# Altium schematic sheet E17-12-VCU-CONN.SchDoc
size A4
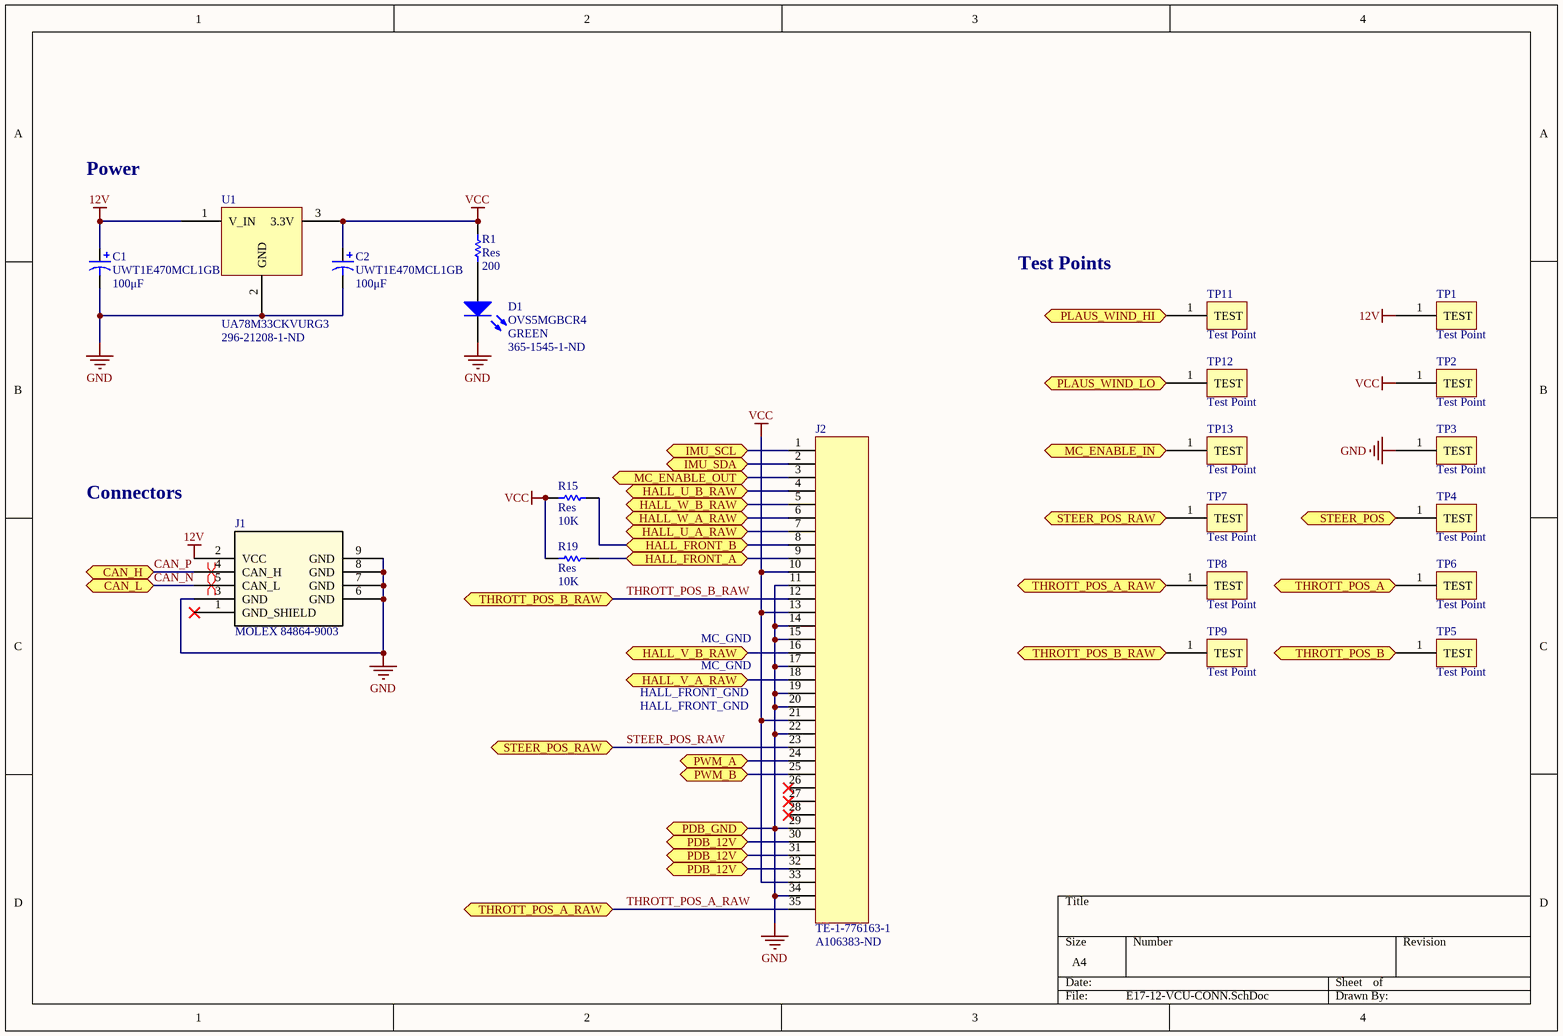
[diagram p0: E17-12-VCU-CONN.SchDoc]

## Parts
C1  UWT1E470MCL1GB  value 100μF  [UWT1E470MCL1GB]
C2  UWT1E470MCL1GB  value 100μF  [UWT1E470MCL1GB]
D1  OVS5MGBCR4  Colour: GREEN  Supplier Part Number 1: 365-1545-1-ND  [OVS5MGBCR4]
J1  MOLEX 84864-9003  [MOLEX 84864-9003]
J2  TE-1-776163-1  Supplier Part Number 1: A106383-ND  [TE-1-776163-1]
R1  Res  value 200  [2012[0805]]
R15  Res  value 10K  [2012[0805]]
R19  Res  value 10K  [2012[0805]]
TP1  Test Point  [TEST POINT 5000K]
TP2  Test Point  [TEST POINT 5000K]
TP3  Test Point  [TEST POINT 5000K]
TP4  Test Point  [TEST POINT 5000K]
TP5  Test Point  [TEST POINT 5000K]
TP6  Test Point  [TEST POINT 5000K]
TP7  Test Point  [TEST POINT 5000K]
TP8  Test Point  [TEST POINT 5000K]
TP9  Test Point  [TEST POINT 5000K]
TP11  Test Point  [TEST POINT 5000K]
TP12  Test Point  [TEST POINT 5000K]
TP13  Test Point  [TEST POINT 5000K]
U1  UA78M33CKVURG3  Supplier Part Number 1: 296-21208-1-ND  [TO-252-3]

## Ports
CAN_H, CAN_L, HALL_FRONT_A, HALL_FRONT_B, HALL_U_A_RAW, HALL_U_B_RAW, HALL_V_A_RAW, HALL_V_B_RAW, HALL_W_A_RAW, HALL_W_B_RAW, IMU_SCL, IMU_SDA, MC_ENABLE_IN, MC_ENABLE_OUT, PDB_12V, PDB_GND, PLAUS_WIND_HI, PLAUS_WIND_LO, PWM_A, PWM_B, STEER_POS, STEER_POS_RAW, THROTT_POS_A, THROTT_POS_A_RAW, THROTT_POS_B, THROTT_POS_B_RAW

## Nets
12V: C1.1 J1.2(VCC) TP1.1(TEST) U1.1(V_IN)
GND: C1.2 C2.2 D1.2(K) J1.3(GND) J1.6(GND) J1.7(GND) J1.8(GND) J1.9(GND) J2.11 J2.14 J2.15 J2.17 J2.19 J2.20 J2.22 J2.29 J2.34 TP3.1(TEST) U1.2(GND) ; port PDB_GND
VCC: C2.1 J2.10 J2.13 J2.21 J2.33 R1.2 R15.1 R19.2 TP2.1(TEST) U1.3(3.3V)
CAN_N: J1.5(CAN_L) ; port CAN_L
CAN_P: J1.4(CAN_H) ; port CAN_H
HALL_FRONT_A: J2.9 R19.1 ; port HALL_FRONT_A
HALL_FRONT_B: J2.8 R15.2 ; port HALL_FRONT_B
HALL_U_A_RAW: J2.7 ; port HALL_U_A_RAW
HALL_U_B_RAW: J2.4 ; port HALL_U_B_RAW
HALL_V_A_RAW: J2.18 ; port HALL_V_A_RAW
HALL_V_B_RAW: J2.16 ; port HALL_V_B_RAW
HALL_W_A_RAW: J2.6 ; port HALL_W_A_RAW
HALL_W_B_RAW: J2.5 ; port HALL_W_B_RAW
IMU_SCL: J2.1 ; port IMU_SCL
IMU_SDA: J2.2 ; port IMU_SDA
MC_ENABLE_IN: TP13.1(TEST) ; port MC_ENABLE_IN
MC_ENABLE_OUT: J2.3 ; port MC_ENABLE_OUT
PDB_12V: J2.30 J2.31 J2.32 ; port PDB_12V
PLAUS_WIND_HI: TP11.1(TEST) ; port PLAUS_WIND_HI
PLAUS_WIND_LO: TP12.1(TEST) ; port PLAUS_WIND_LO
PWM_A: J2.24 ; port PWM_A
PWM_B: J2.25 ; port PWM_B
STEER_POS: TP4.1(TEST) ; port STEER_POS
STEER_POS_RAW: J2.23 TP7.1(TEST) ; port STEER_POS_RAW
THROTT_POS_A: TP6.1(TEST) ; port THROTT_POS_A
THROTT_POS_A_RAW: J2.35 TP8.1(TEST) ; port THROTT_POS_A_RAW
THROTT_POS_B: TP5.1(TEST) ; port THROTT_POS_B
THROTT_POS_B_RAW: J2.12 TP9.1(TEST) ; port THROTT_POS_B_RAW
NetD1_1: D1.1(A) R1.1

Not connected (* = marked no-connect by the designer): J1 1(GND_SHIELD)*; J2 26* 27* 28*

## Layout directives
differential pair: CAN_N, CAN_P

## Notes on the sheet
- Power
- Test Points
- Connectors
- MC_GND
- HALL_FRONT_GND

## Library data of the parts
C1 C2 = UWT1E470MCL1GB: CAP ALUM 47UF 25V 20% SMD; Published: 8-Jun-2000; LatestRevisionDate: 17-Jul-2002; LatestRevisionNote: Re-released for DXP Platform.; PackageReference: POLAR0.8; Publisher: Altium Limited; PackageDescription: Polarized Capacitor; 2 Leads
D1 = OVS5MGBCR4: Typical GREEN LED; Published: 8-Jun-2000; LatestRevisionDate: 17-Jul-2002; LatestRevisionNote: Re-released for DXP Platform.; PackageDocument: Feb-2002; PackageReference: 3.2X1.6X1.1; Publisher: Altium Limited; Supplier 1: Digi-Key
J1 = MOLEX 84864-9003: CAN Micro-Change M12, Right Angle, Male
J2 = TE-1-776163-1: CONN HEADER 35POS R/A GOLD BLACK; Supplier 1: Digi-Key
R1 R15 R19 = Res: Surface Mount Resistor; Published: 8-Jun-2000; LatestRevisionDate: 17-Jul-2002; LatestRevisionNote: Re-released for DXP Platform.; PackageReference: AXIAL-0.5; Publisher: Altium Limited
TP1-TP9 TP11-TP13 = Test Point: 5000-5004, 5015-5019 Keystone Electronics
U1 = UA78M33CKVURG3: 3.3V Regulator; Supplier 1: Digi-Key